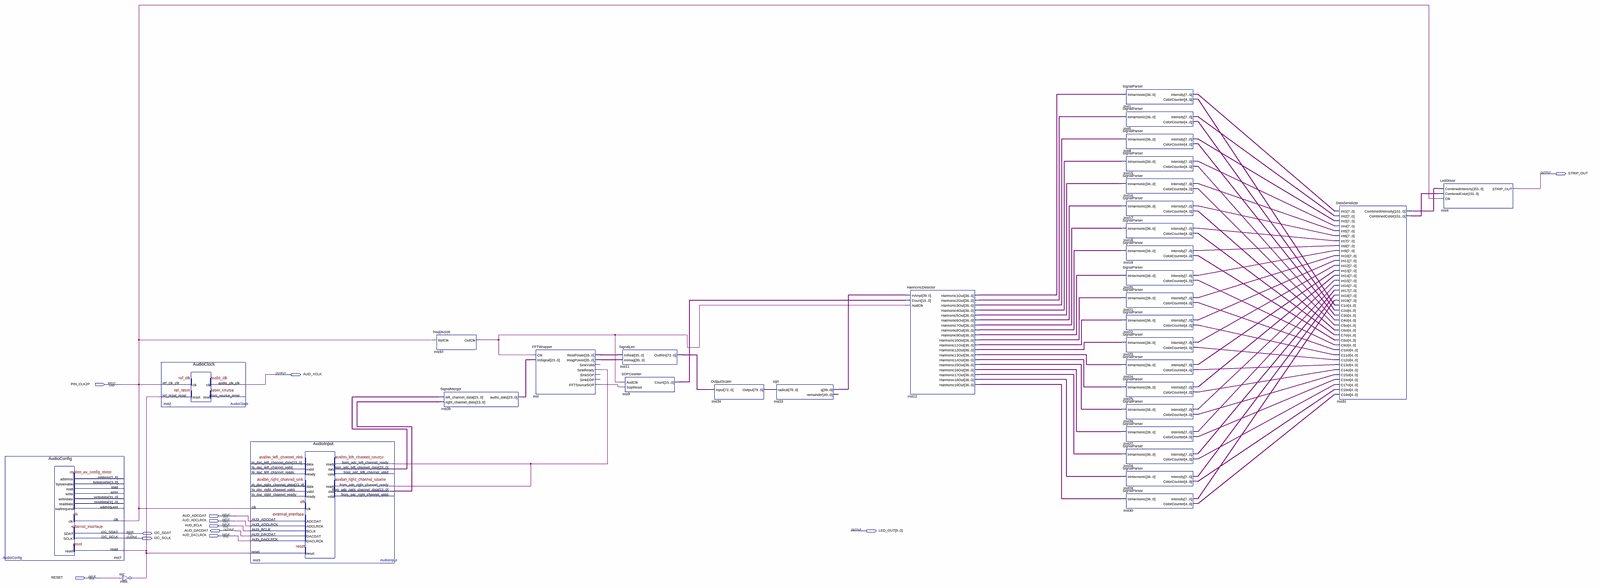
[diagram p0: schematic sheet, whole]
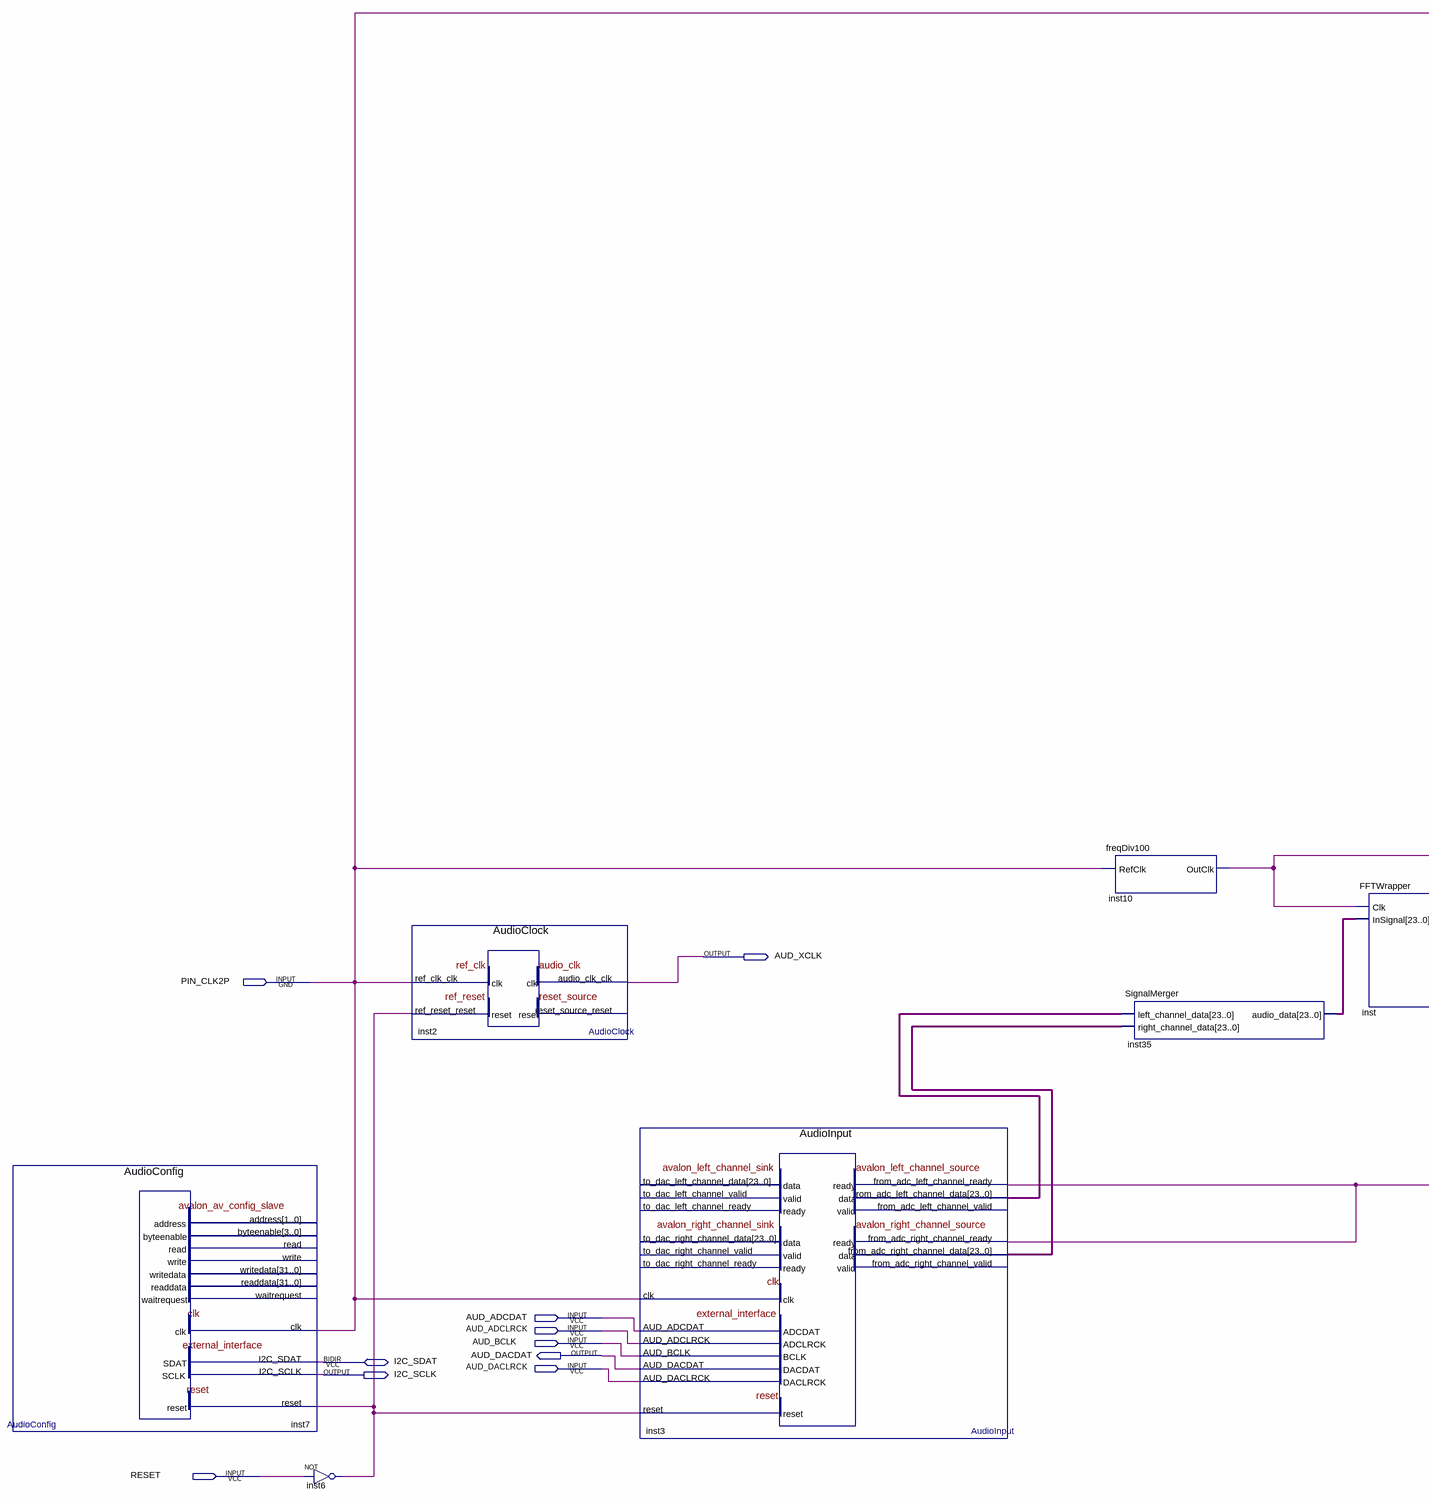
[diagram p1: schematic sheet, left part]
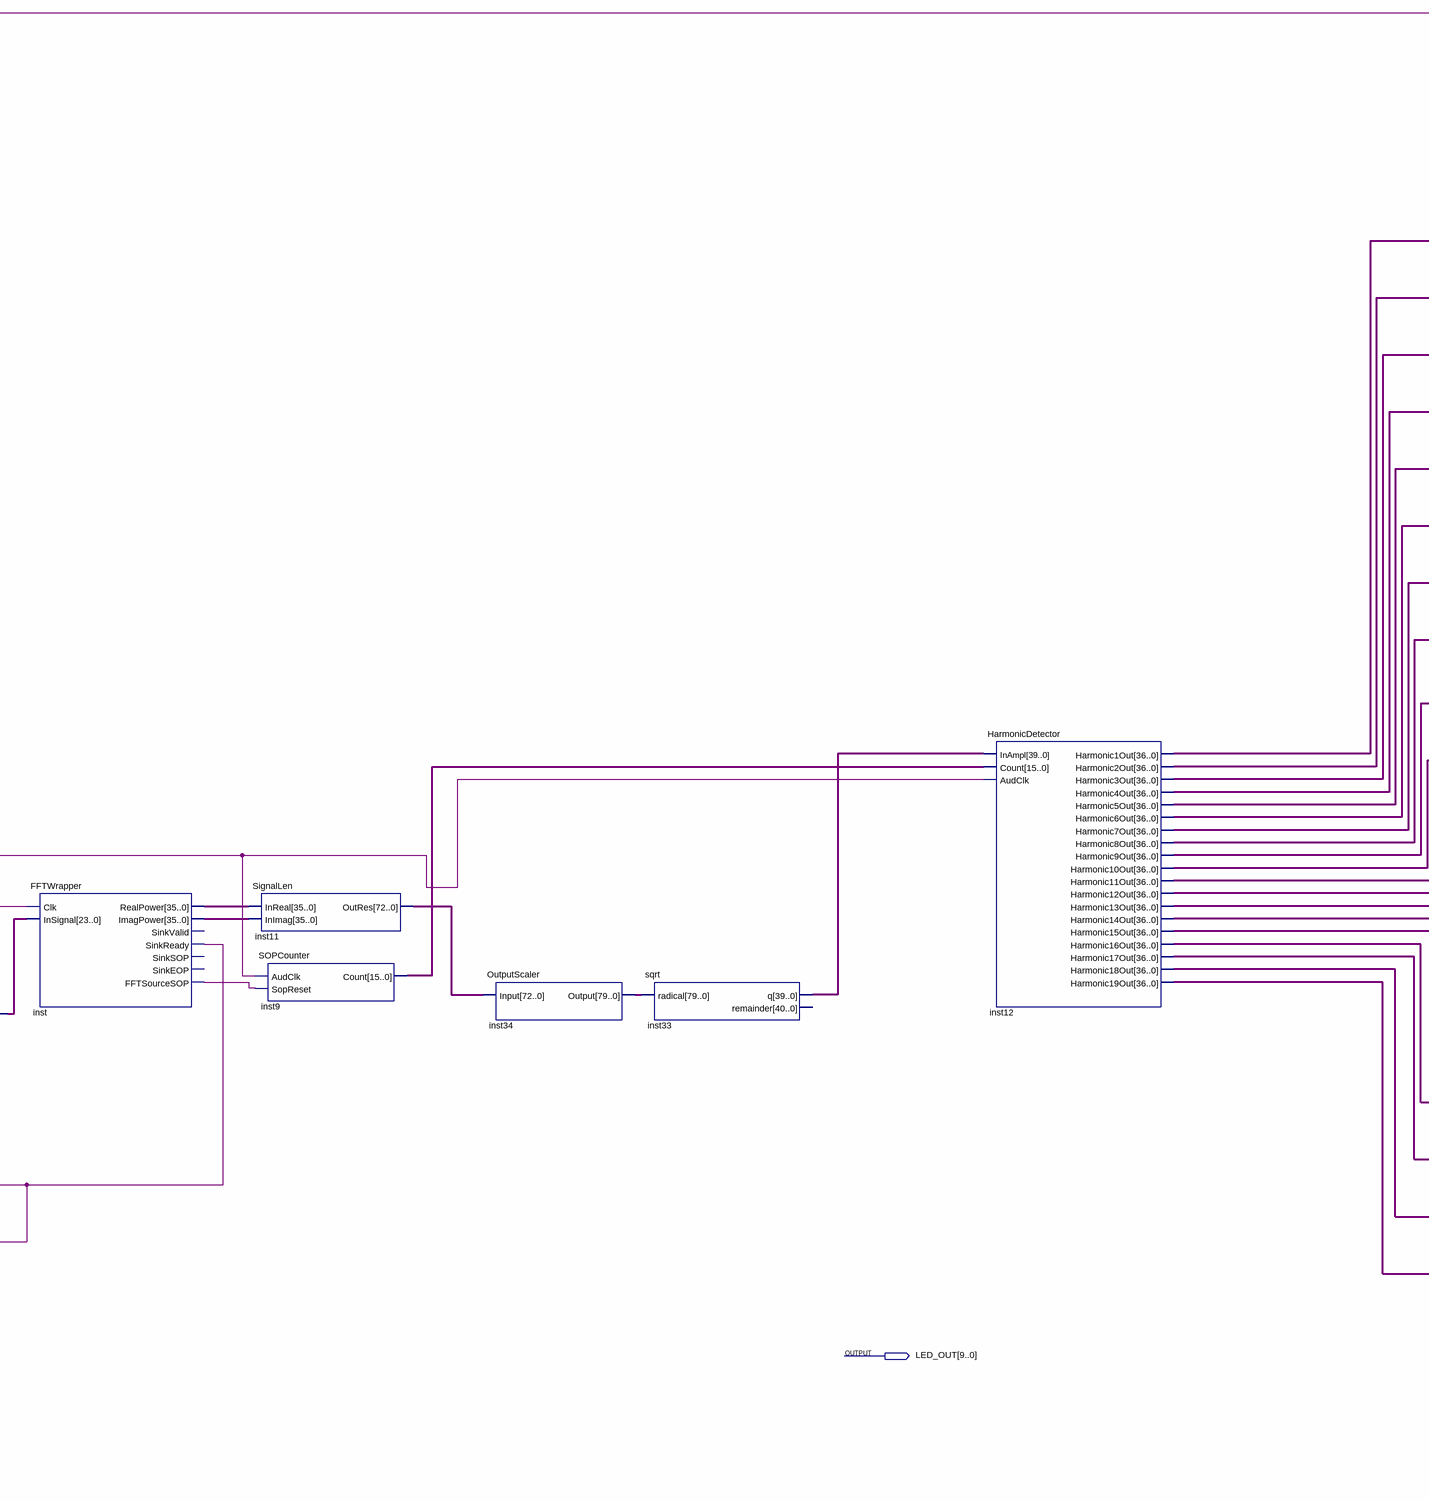
[diagram p2: schematic sheet, centre part]
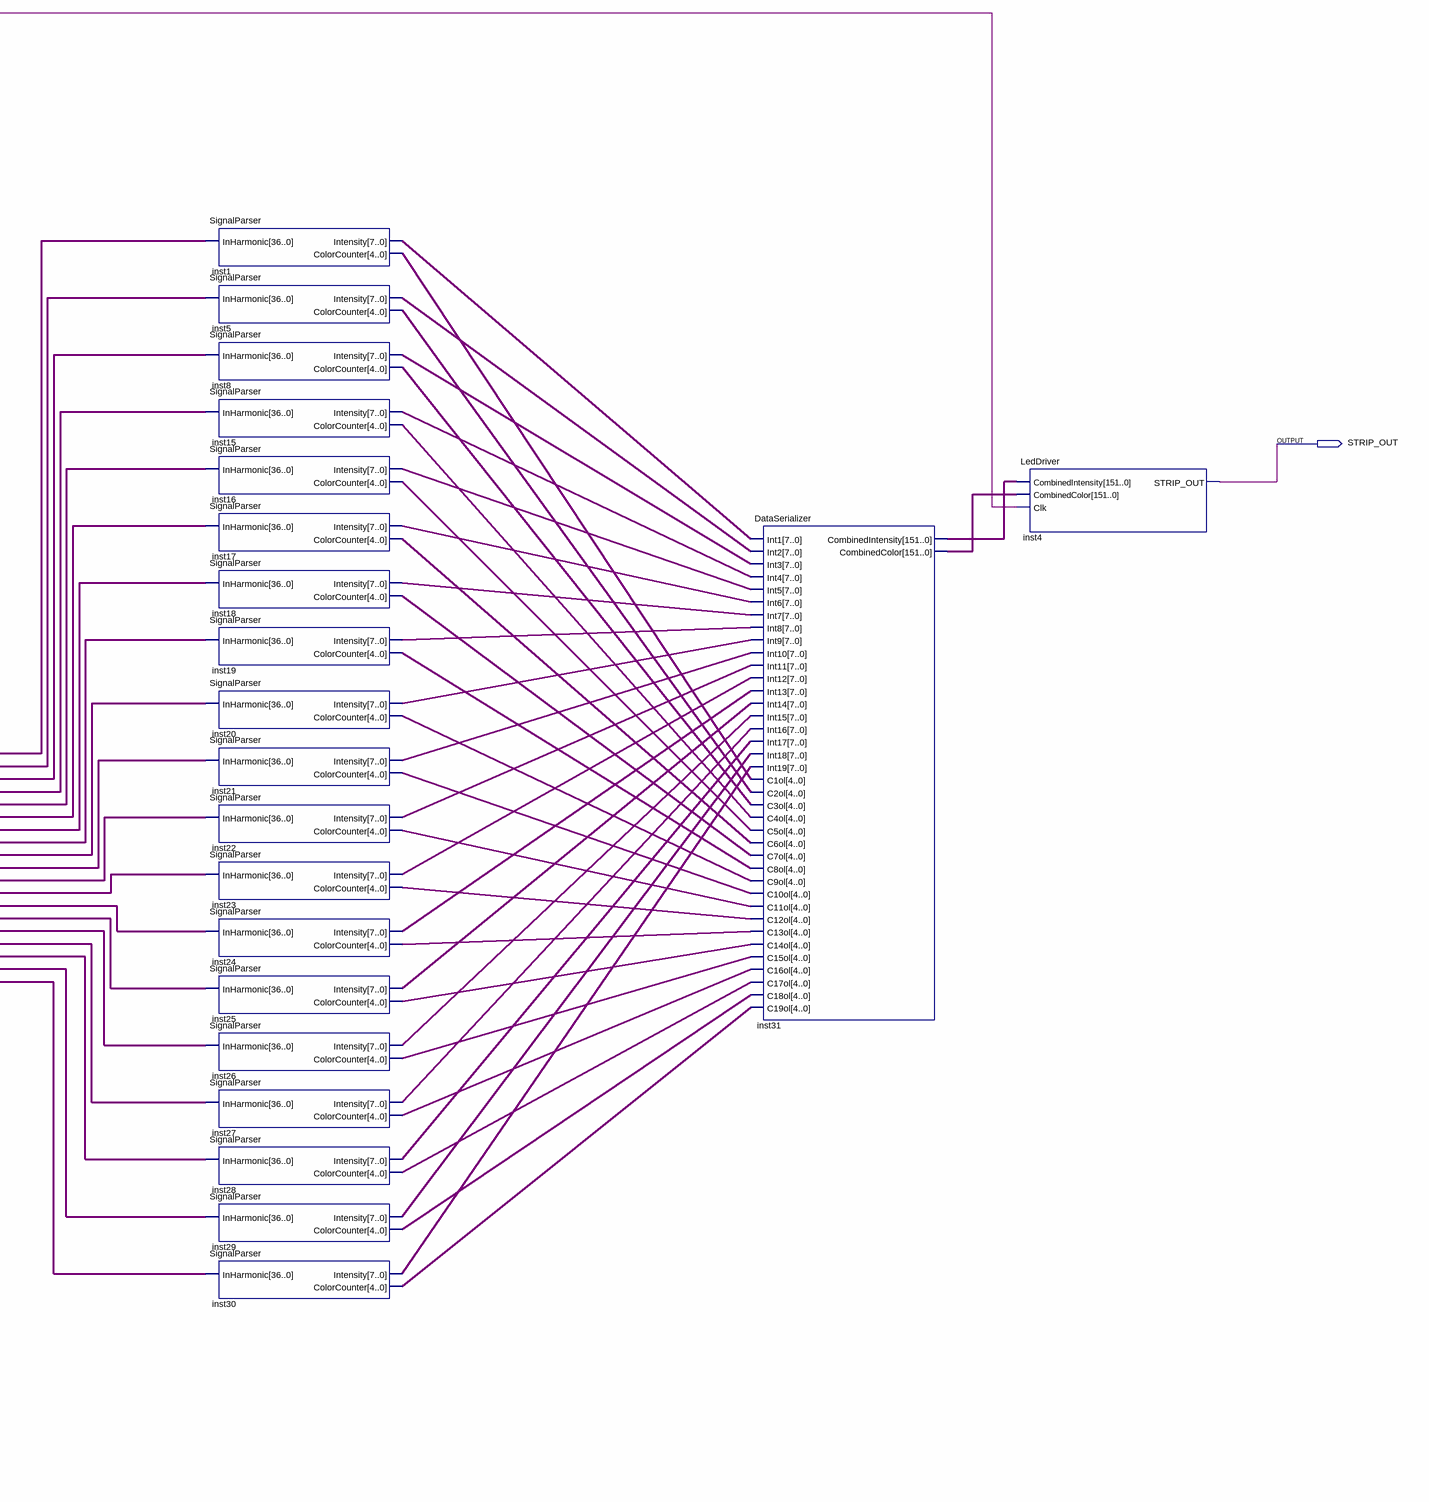
[diagram p3: schematic sheet, right part]
// Quartus schematic AudioLED.bdf as structural Verilog: 33 symbols, 12 pins
module AudioLED (
  input  PIN_CLK2P,
  input  AUD_ADCDAT,
  input  AUD_ADCLRCK,
  input  AUD_BCLK,
  input  AUD_DACLRCK,
  input  RESET,
  inout  I2C_SDAT,
  output STRIP_OUT,
  output AUD_XCLK,
  output AUD_DACDAT,
  output [9:0] LED_OUT,
  output I2C_SCLK
);

  wire inst6_out, inst10_outclk, inst_fftsourcesop, inst_sinkready;
  wire [4:0] inst1_colorcounter, inst5_colorcounter, inst8_colorcounter, inst15_colorcounter,
       inst16_colorcounter, inst17_colorcounter, inst18_colorcounter, inst19_colorcounter,
       inst20_colorcounter, inst21_colorcounter, inst22_colorcounter, inst23_colorcounter,
       inst24_colorcounter, inst25_colorcounter, inst26_colorcounter, inst27_colorcounter,
       inst28_colorcounter, inst29_colorcounter, inst30_colorcounter;
  wire [7:0] inst1_intensity, inst5_intensity, inst8_intensity, inst15_intensity, inst16_intensity,
       inst17_intensity, inst18_intensity, inst19_intensity, inst20_intensity, inst21_intensity,
       inst22_intensity, inst23_intensity, inst24_intensity, inst25_intensity, inst26_intensity,
       inst27_intensity, inst28_intensity, inst29_intensity, inst30_intensity;
  wire [15:0] inst9_count;
  wire [23:0] inst3_from_adc_left_channel_data, inst3_from_adc_right_channel_data, inst35_audio_data;
  wire [35:0] inst_imagpower, inst_realpower;
  wire [36:0] inst12_harmonic1out, inst12_harmonic2out, inst12_harmonic3out, inst12_harmonic4out,
       inst12_harmonic5out, inst12_harmonic6out, inst12_harmonic7out, inst12_harmonic8out,
       inst12_harmonic9out, inst12_harmonic10out, inst12_harmonic11out, inst12_harmonic12out,
       inst12_harmonic13out, inst12_harmonic14out, inst12_harmonic15out, inst12_harmonic16out,
       inst12_harmonic17out, inst12_harmonic18out, inst12_harmonic19out;
  wire [39:0] inst33_q;
  wire [72:0] inst11_outres;
  wire [79:0] inst34_output;
  wire [151:0] inst31_combinedcolor, inst31_combinedintensity;

  AudioConfig inst7 (
    .clk(PIN_CLK2P), .reset(inst6_out), .I2C_SCLK(I2C_SCLK), .I2C_SDAT(I2C_SDAT));  // open: address, byteenable, read, write, writedata, readdata, waitrequest
  not inst6 (inst6_out, RESET);
  AudioClock inst2 (
    .ref_clk_clk(PIN_CLK2P), .ref_reset_reset(inst6_out), .audio_clk_clk(AUD_XCLK));  // open: reset_source_reset
  AudioInput inst3 (
    .from_adc_left_channel_ready(inst_sinkready), .from_adc_right_channel_ready(inst_sinkready),
    .clk(PIN_CLK2P), .AUD_ADCDAT(AUD_ADCDAT), .AUD_ADCLRCK(AUD_ADCLRCK), .AUD_BCLK(AUD_BCLK),
    .AUD_DACLRCK(AUD_DACLRCK), .reset(inst6_out),
    .from_adc_left_channel_data(inst3_from_adc_left_channel_data),
    .from_adc_right_channel_data(inst3_from_adc_right_channel_data), .AUD_DACDAT(AUD_DACDAT));  // open: to_dac_left_channel_data, to_dac_left_channel_valid, to_dac_right_channel_data, to_dac_right_channel_valid, to_dac_left_channel_ready, from_adc_left_channel_valid, to_dac_right_channel_ready, from_adc_right_channel_valid
  freqDiv100 inst10 (.RefClk(PIN_CLK2P), .OutClk(inst10_outclk));
  SignalMerger inst35 (
    .left_channel_data(inst3_from_adc_left_channel_data),
    .right_channel_data(inst3_from_adc_right_channel_data), .audio_data(inst35_audio_data));
  FFTWrapper inst (
    .Clk(inst10_outclk), .InSignal(inst35_audio_data), .RealPower(inst_realpower),
    .ImagPower(inst_imagpower), .SinkReady(inst_sinkready), .FFTSourceSOP(inst_fftsourcesop));  // open: SinkValid, SinkSOP, SinkEOP
  SignalLen inst11 (.InReal(inst_realpower), .InImag(inst_imagpower), .OutRes(inst11_outres));
  SOPCounter inst9 (.AudClk(inst10_outclk), .SopReset(inst_fftsourcesop), .Count(inst9_count));
  OutputScaler inst34 (.Input(inst11_outres), .Output(inst34_output));
  sqrt inst33 (.radical(inst34_output), .q(inst33_q));  // open: remainder
  HarmonicDetector inst12 (
    .InAmpl(inst33_q), .Count(inst9_count), .AudClk(inst10_outclk), .Harmonic1Out(inst12_harmonic1out),
    .Harmonic2Out(inst12_harmonic2out), .Harmonic3Out(inst12_harmonic3out),
    .Harmonic4Out(inst12_harmonic4out), .Harmonic5Out(inst12_harmonic5out),
    .Harmonic6Out(inst12_harmonic6out), .Harmonic7Out(inst12_harmonic7out),
    .Harmonic8Out(inst12_harmonic8out), .Harmonic9Out(inst12_harmonic9out),
    .Harmonic10Out(inst12_harmonic10out), .Harmonic11Out(inst12_harmonic11out),
    .Harmonic12Out(inst12_harmonic12out), .Harmonic13Out(inst12_harmonic13out),
    .Harmonic14Out(inst12_harmonic14out), .Harmonic15Out(inst12_harmonic15out),
    .Harmonic16Out(inst12_harmonic16out), .Harmonic17Out(inst12_harmonic17out),
    .Harmonic18Out(inst12_harmonic18out), .Harmonic19Out(inst12_harmonic19out));
  SignalParser inst1 (.InHarmonic(inst12_harmonic1out), .Intensity(inst1_intensity), .ColorCounter(inst1_colorcounter));
  SignalParser inst5 (.InHarmonic(inst12_harmonic2out), .Intensity(inst5_intensity), .ColorCounter(inst5_colorcounter));
  SignalParser inst8 (.InHarmonic(inst12_harmonic3out), .Intensity(inst8_intensity), .ColorCounter(inst8_colorcounter));
  SignalParser inst15 (
    .InHarmonic(inst12_harmonic4out), .Intensity(inst15_intensity), .ColorCounter(inst15_colorcounter));
  SignalParser inst16 (
    .InHarmonic(inst12_harmonic5out), .Intensity(inst16_intensity), .ColorCounter(inst16_colorcounter));
  SignalParser inst17 (
    .InHarmonic(inst12_harmonic6out), .Intensity(inst17_intensity), .ColorCounter(inst17_colorcounter));
  SignalParser inst18 (
    .InHarmonic(inst12_harmonic7out), .Intensity(inst18_intensity), .ColorCounter(inst18_colorcounter));
  SignalParser inst19 (
    .InHarmonic(inst12_harmonic8out), .Intensity(inst19_intensity), .ColorCounter(inst19_colorcounter));
  SignalParser inst20 (
    .InHarmonic(inst12_harmonic9out), .Intensity(inst20_intensity), .ColorCounter(inst20_colorcounter));
  SignalParser inst21 (
    .InHarmonic(inst12_harmonic10out), .Intensity(inst21_intensity), .ColorCounter(inst21_colorcounter));
  SignalParser inst22 (
    .InHarmonic(inst12_harmonic11out), .Intensity(inst22_intensity), .ColorCounter(inst22_colorcounter));
  SignalParser inst23 (
    .InHarmonic(inst12_harmonic12out), .Intensity(inst23_intensity), .ColorCounter(inst23_colorcounter));
  SignalParser inst24 (
    .InHarmonic(inst12_harmonic13out), .Intensity(inst24_intensity), .ColorCounter(inst24_colorcounter));
  SignalParser inst25 (
    .InHarmonic(inst12_harmonic14out), .Intensity(inst25_intensity), .ColorCounter(inst25_colorcounter));
  SignalParser inst26 (
    .InHarmonic(inst12_harmonic15out), .Intensity(inst26_intensity), .ColorCounter(inst26_colorcounter));
  SignalParser inst27 (
    .InHarmonic(inst12_harmonic16out), .Intensity(inst27_intensity), .ColorCounter(inst27_colorcounter));
  SignalParser inst28 (
    .InHarmonic(inst12_harmonic17out), .Intensity(inst28_intensity), .ColorCounter(inst28_colorcounter));
  SignalParser inst29 (
    .InHarmonic(inst12_harmonic18out), .Intensity(inst29_intensity), .ColorCounter(inst29_colorcounter));
  SignalParser inst30 (
    .InHarmonic(inst12_harmonic19out), .Intensity(inst30_intensity), .ColorCounter(inst30_colorcounter));
  DataSerializer inst31 (
    .Int1(inst1_intensity), .Int2(inst5_intensity), .Int3(inst8_intensity), .Int4(inst15_intensity),
    .Int5(inst16_intensity), .Int6(inst17_intensity), .Int7(inst18_intensity), .Int8(inst19_intensity),
    .Int9(inst20_intensity), .Int10(inst21_intensity), .Int11(inst22_intensity), .Int12(inst23_intensity),
    .Int13(inst24_intensity), .Int14(inst25_intensity), .Int15(inst26_intensity), .Int16(inst27_intensity),
    .Int17(inst28_intensity), .Int18(inst29_intensity), .Int19(inst30_intensity), .C1ol(inst1_colorcounter),
    .C2ol(inst5_colorcounter), .C3ol(inst8_colorcounter), .C4ol(inst15_colorcounter),
    .C5ol(inst16_colorcounter), .C6ol(inst17_colorcounter), .C7ol(inst18_colorcounter),
    .C8ol(inst19_colorcounter), .C9ol(inst20_colorcounter), .C10ol(inst21_colorcounter),
    .C11ol(inst22_colorcounter), .C12ol(inst23_colorcounter), .C13ol(inst24_colorcounter),
    .C14ol(inst25_colorcounter), .C15ol(inst26_colorcounter), .C16ol(inst27_colorcounter),
    .C17ol(inst28_colorcounter), .C18ol(inst29_colorcounter), .C19ol(inst30_colorcounter),
    .CombinedIntensity(inst31_combinedintensity), .CombinedColor(inst31_combinedcolor));
  LedDriver inst4 (
    .CombinedIntensity(inst31_combinedintensity), .CombinedColor(inst31_combinedcolor), .Clk(PIN_CLK2P),
    .STRIP_OUT(STRIP_OUT));
endmodule
